# Altium schematic sheet Neopixel_Driver.SchDoc
size B; Author: AM; CompanyName: Expatria Technologies; DrawnBy: A.Marles; Engineer: AM; Organization: Expatria Technolgoies; Address1: PO Box 2084; Address3: Merritt, BC V1K 1B8; Address4: Canada; DocumentNumber: 11; SheetNumber: 11; SheetTotal: 27
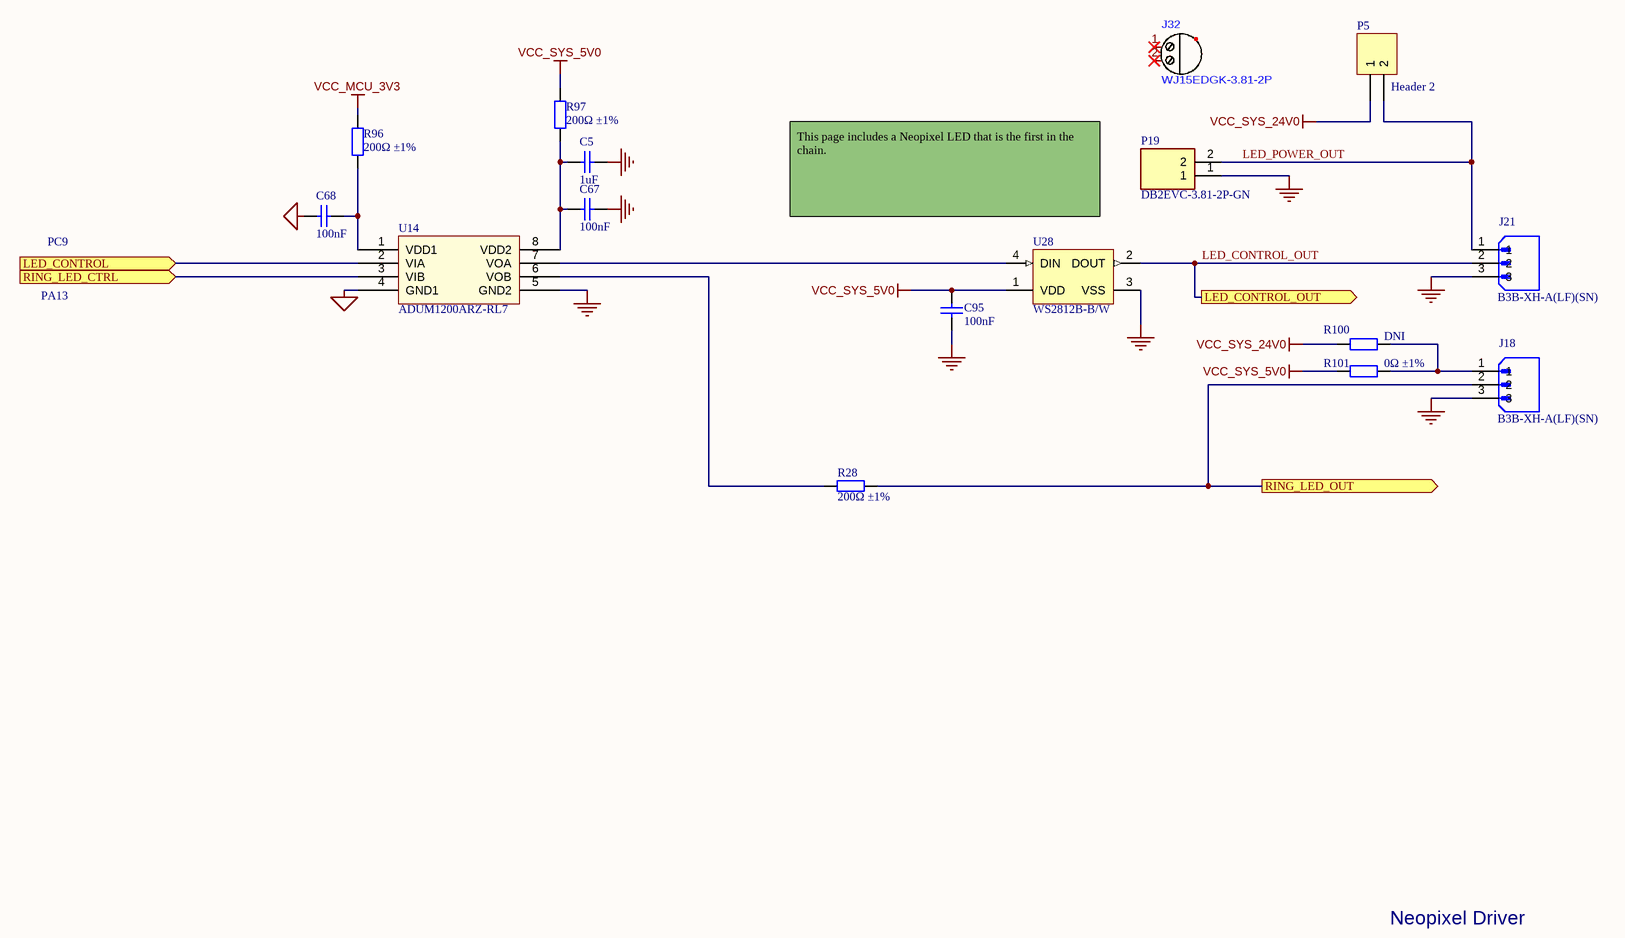
[diagram p0: Neopixel_Driver.SchDoc]

## Parts
C5  1uF  [0603_C]
C67  100nF  [0603_C]
C68  100nF  [0603_C]
C95  100nF  [0603_C]
J18  B3B-XH-A(LF)(SN)  [JST_B3B-XH-A(LF)(SN)]
J21  B3B-XH-A(LF)(SN)  [JST_B3B-XH-A(LF)(SN)]
J32  WJ15EDGK-3.81-2P  (mechanical)
P5  Header 2  [HDR1X2]
P19  DB2EVC-3.81-2P-GN  [CONN-TH_5P-P3.81_DB2EVC-3.81-2p]
R28  200Ω ±1%  [0402_R]
R96  200Ω ±1%  [0402_R]
R97  200Ω ±1%  [0402_R]
R100  DNI  [0603_R]
R101  0Ω ±1%  [0603_R]
U14  ADUM1200ARZ-RL7  [SOIC-8_150mil]
U28  WS2812B-B/W  [ADA-RGB-1655_V]

## Ports
LED_CONTROL (in), LED_CONTROL_OUT (out), RING_LED_CTRL (in), RING_LED_OUT (out)

## Nets
GND: C5.1 C67.1 C95.1 J18.3 J21.3 P19.1 U14.5(GND2) U28.3(VSS)
MCU_GND: C68.2 U14.4(GND1)
VCC_MCU_3V3: R96.2
VCC_SYS_5V0: C95.2 R97.2 R101.2 U28.1(VDD)
VCC_SYS_24V0: P5.1 R100.2
LED_CONTROL: U14.2(VIA) ; port LED_CONTROL
LED_CONTROL_OUT: J21.2 U28.2(DOUT) ; port LED_CONTROL_OUT
LED_POWER_OUT: J21.1 P5.2 P19.2
RING_LED_CTRL: U14.3(VIB) ; port RING_LED_CTRL
RING_LED_OUT: J18.2 R28.1 ; port RING_LED_OUT
NetC5_2: C5.2 C67.2 R97.1 U14.8(VDD2)
NetC68_1: C68.1 R96.1 U14.1(VDD1)
NetJ18_1: J18.1 R100.1 R101.1
NetR28_2: R28.2 U14.6(VOB)
NetU14_7: U14.7(VOA) U28.4(DIN)

Not connected (* = marked no-connect by the designer): J32 1* 2*

## Notes on the sheet
- PC9
- (near U28) This page includes a Neopixel LED that is the first in the chain.
- PA13
- Neopixel Driver
- SHEET
- Expatria Technologies
- 625 Kane Valley Rd.
- Box 2084
- Merritt, BC V1K1B8
- PROJECT
- SIZE
- ENGR
- MODIFIED
- DOCUMENT
- REV
- Copyright Sienci Labs 2024. This document describes Open Hardware and is licensed under the CERN-OHL-S v2. No warranty is implied or expressed.
- EMAIL: INFO@EXPATRIA.CA
- B
- /

## Library data of the parts
C5 = 0603 1uF (105) 10% 50V: Chip capacitors; Manufacturer: Samsung Electro-Mechanics; Manufacturer Part Number: CL10A105KB8NNNC; Tolerance: 10%; Voltage: 50V; Package: 0603; Supplier: LC; SuppliersPartNumber: C15849; Capacitance: 1uF; Manufacturer 1: Samsung Electro-Mechanics
C67 C68 C95 = 0603 100nF (104) 10% 50V: 50V 100nF X7R ±10% 0603 Multilayer Ceramic Capacitors MLCC - SMD/SMT ROHS; Manufacturer: YAGEO; Manufacturer Part Number: CC0603KRX7R9BB104; ComponentLink1Description: Supplier link; ComponentLink1URL: http://www.szlcsc.com/product/details_15331.html; Package: 0603; Supplier: LC; SuppliersPartNumber: C14663; Capacitance: 100nF; Tolerance: 10%; Voltage: 50V
J18 J21 = B3B-XH-A(LF)(SN): Connector Header Through Hole 3 position 0.098" (2.50mm); Manufacturer: JST Sales America; Manufacturer Part Number: B3B-XH-A(LF)(SN); SuppliersPartNumber: C144394; MP: B3B-XH-A(LF)(SN); Value: B3B-XH-A(LF)(SN); Supplier: LCSC
J32 = WJ15EDGK-3.81-2P: 2 1 3.81mm Green Plug P=3.81mm Pluggable System Terminal Block ROHS; Manufacturer: Ningbo; Supplier: LCSC; Supplier Part Number 1: C8466; Manufacturer Part Number: WJ15EDGK-3.81-2P; RoHS: Yes; SuppliersPartNumber: C8466
P5 = Header 2: Straight Square Pins 2 2.54mm Black Brass 1x2P Plugin,P=2.54mm Pin Headers ROHS; Manufacturer: MOLEX; Manufacturer Part Number: 22284020; Publisher: Altium Limited; LatestRevisionDate: 17-Jul-2002; LatestRevisionNote: Re-released for DXP Platform.; SuppliersPartNumber: C234182; Supplier 1: LCSC; Supplier Part Number 1: C234182
P19 = DB2EVC-3.81-2P-GN: 3.81mm Green Board Edge/Receptacle-Close Push-Pull,P=3.81mm Pluggable System Terminal Block ROHS; Manufacturer: DIBO; SuppliersPartNumber: C395686; Manufacturer Part Number: DB2EVC-3.81-2P-GN; Supplier: LCSC; Value: DB2EVC-3.81-2P-GN
R28 R96 R97 = 0402 200R (2000) 1%: Chip resistor; Manufacturer: Uniroyal Elec; Manufacturer Part Number: 0402WGF2000TCE; Power: 1/16W; ComponentLink1Description: Supplier link; ComponentLink1URL: http://www.szlcsc.com/product/details_25830.html; Package: 0402; Supplier: LC; SuppliersPartNumber: C25087; Resistance: 200Ω; Tolerance: 1%
R100 = 0603 0R (0R0) 1%: Chip resistor; Manufacturer: Uniroyal Elec; Manufacturer Part Number: 0603WAF0000T5E; Power: 1/10W; Resistance: 0Ω; Tolerance: 1%; ComponentLink1Description: Supplier link; ComponentLink1URL: http://www.szlcsc.com/product/details_21903.html; Package: 0603; Supplier: LC; SuppliersPartNumber: C21189
R101 = 0603 0R (0R0) 1%: Chip resistor; Manufacturer: Uniroyal Elec; Manufacturer Part Number: 0603WAF0000T5E; Power: 1/10W; ComponentLink1Description: Supplier link; ComponentLink1URL: http://www.szlcsc.com/product/details_21903.html; Package: 0603; Supplier: LC; SuppliersPartNumber: C21189; Resistance: 0Ω; Tolerance: 1%
U14 = ADUM1200ARZ-RL7: Dual Channel Isolator; Manufacturer: Analog Devices; Package: SOIC-8_150mil; Supplier: LC; SuppliersPartNumber: C15219; ComponentLink1Description: 供应商链接; ComponentLink1URL: http://www.szlcsc.com/product/details_10199.html; Manufacturer Part Number: ADUM1200ARZ-RL7
U28 = WS2812B-B/W: Intelligent Control LED Integrated Light Source, 3.5 to 5.3 V, -25 to 80 degC, 4-Pin SMD, RoHS, Tape and Reel; Manufacturer: Worldsemi; Manufacturer 1: Adafruit Industries; Manufacturer Part Number 1: 1655; Package Description: 4-Pin Surface Mount Device, Body 5 x 5 mm; SuppliersPartNumber: C2761795; Manufacturer Part Number: WS2812B-B/W; Supplier: LCSC